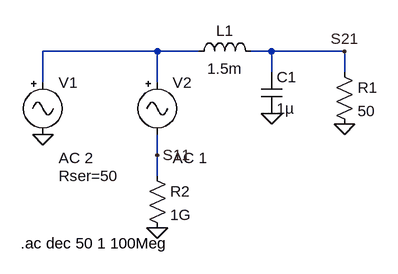
[diagram p0: schematic Diplexer.asc]
Diplexer.asc, the LTspice schematic file:
Version 4
SHEET 1 880 680
WIRE 64 112 -112 112
WIRE 128 112 64 112
WIRE 240 112 208 112
WIRE 352 112 240 112
WIRE 240 144 240 112
WIRE 352 144 352 112
WIRE -112 160 -112 112
WIRE 64 160 64 112
WIRE 64 272 64 240
WIRE 64 304 64 272
FLAG -112 240 0
FLAG 240 208 0
FLAG 352 224 0
FLAG 64 384 0
FLAG 64 272 S11
FLAG 352 112 S21
SYMBOL ind 112 128 R270
WINDOW 0 32 56 VTop 0
WINDOW 3 5 56 VBottom 0
SYMATTR InstName L1
SYMATTR Value 1.5m
SYMBOL cap 224 144 R0
SYMATTR InstName C1
SYMATTR Value 1µ
SYMBOL res 336 128 R0
SYMATTR InstName R1
SYMATTR Value 50
SYMBOL Misc\\signal -112 144 R0
WINDOW 123 24 132 Left 0
WINDOW 39 24 160 Left 0
SYMATTR InstName V1
SYMATTR Value ""
SYMATTR Value2 AC 2
SYMATTR SpiceLine Rser=50
SYMBOL Misc\\signal 64 144 R0
WINDOW 123 24 132 Left 0
WINDOW 39 0 0 Left 0
SYMATTR InstName V2
SYMATTR Value ""
SYMATTR Value2 AC 1
SYMBOL res 48 288 R0
SYMATTR InstName R2
SYMATTR Value 1G
TEXT -146 408 Left 0 !.ac dec 50 1 100Meg

The netlist it stands for:
* Diplexer.asc
L1 N001 S21 1.5m
C1 S21 0 1µ
R1 S21 0 50
V1 N001 0 AC 2 Rser=50
V2 N001 S11 AC 1
R2 S11 0 1G
.ac dec 50 1 100Meg
.backanno
.end

* Results of the author's LTspice run, read from the files saved beside the schematic
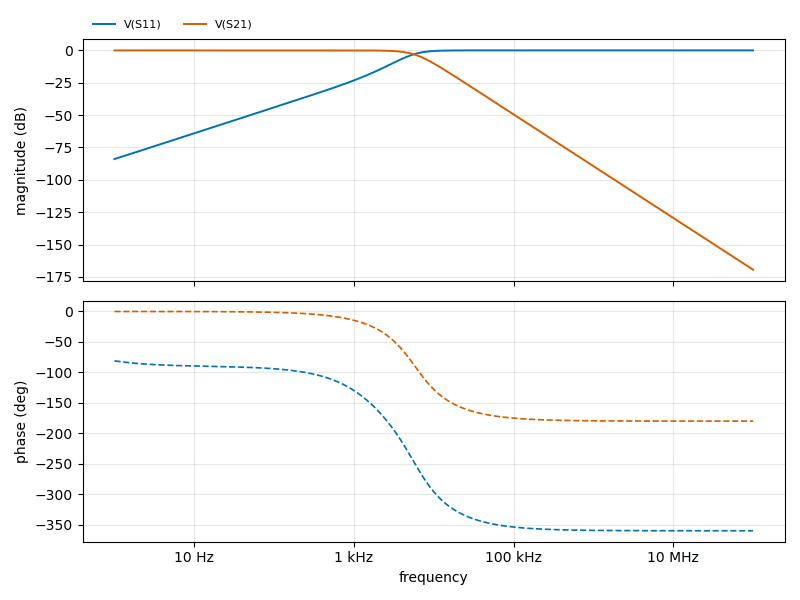
[diagram p1: AC Analysis of Diplexer.asc, plotted from the saved traces]
* AC Analysis, 1 run:
*   V(S11): -83.93 dB at 1 Hz, -0.00 dB at 100 MHz, peak -0.00 dB at 100 MHz, 3 dB below the peak at 5.624 kHz
*   V(S21): -0.00 dB at 1 Hz, -169.43 dB at 100 MHz, peak -0.00 dB at 1 Hz, 3 dB below the peak at 5.618 kHz